# EAGLE design FXOS8700 with Extender (EAGLE 7.3.0)
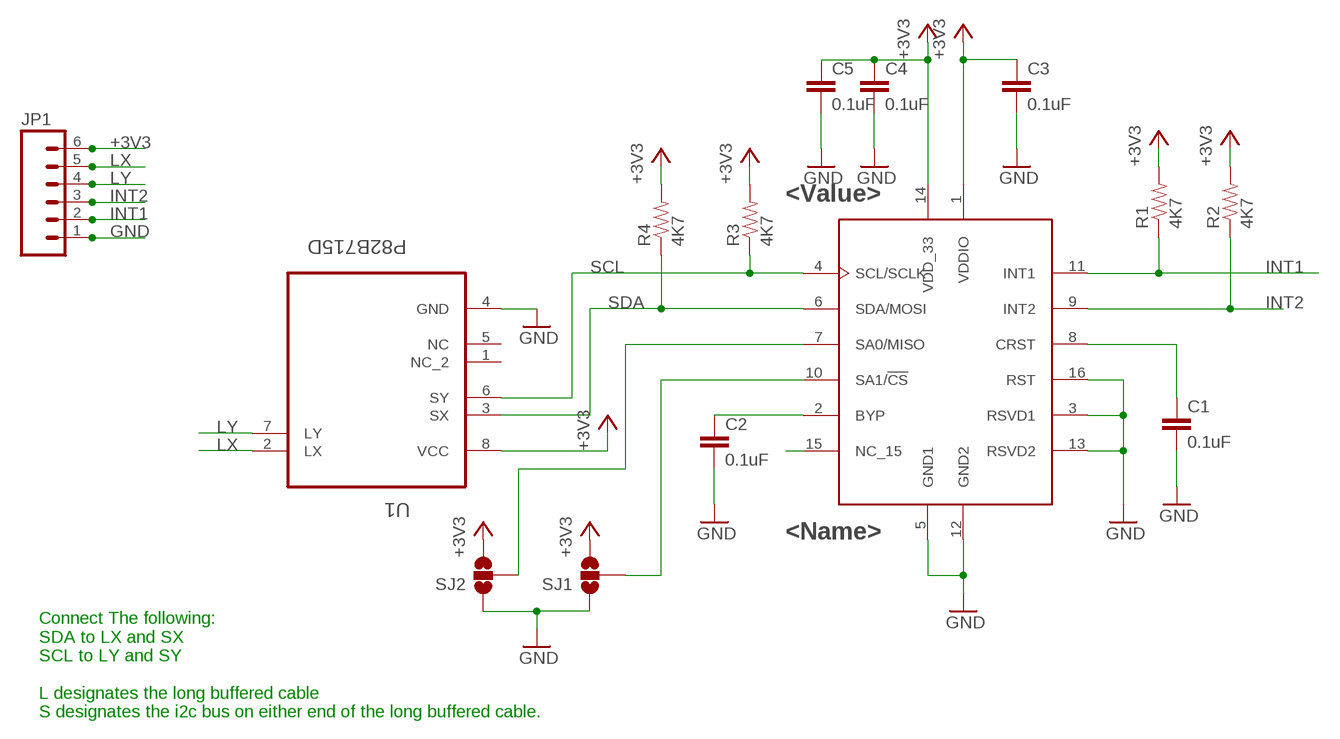
[diagram p0: schematic, sheet 1]

## Parts
C1  0.1uF  CAP0805  [0805]
C2  0.1uF  CAP0805  [0805]
C3  0.1uF  CAP0805  [0805]
C4  0.1uF  CAP0805  [0805]
C5  0.1uF  CAP0805  [0805]
JP1  M06LOCK  [1X06_LOCK]
R1  4K7  RESISTOR0805-RES  [0805]
R2  4K7  RESISTOR0805-RES  [0805]
R3  4K7  RESISTOR0805-RES  [0805]
R4  4K7  RESISTOR0805-RES  [0805]
SJ1  SOLDERJUMPER_2WAYPASTE1&2  [SJ_3_PASTE1&2]
SJ2  SOLDERJUMPER_2WAYPASTE1&2  [SJ_3_PASTE1&2]
U1  P82B715D  [SOIC127P600X175-8N]
U$1  FXOS870CQ  [QFN16_0P5_3X3]

## Nets
+3V3: C3.1 C4.1 C5.1 JP1.6 R1.2 R2.2 R3.2 R4.2 SJ1.3 SJ2.3 U1.8(VCC) U$1.1(VDDIO) U$1.14(VDD_33)
GND: C1.2 C2.2 C3.2 C4.2 C5.2 JP1.1 SJ1.1 SJ2.1 U1.4(GND) U$1.3(RSVD1) U$1.5(GND1) U$1.12(GND2) U$1.13(RSVD2) U$1.16(RST)
INT1: JP1.2 R1.1 U$1.11(INT1)
INT2: JP1.3 R2.1 U$1.9(INT2)
LX: JP1.5 U1.2(LX)
LY: JP1.4 U1.7(LY)
N$5: C2.1 U$1.2(BYP)
N$6: U$1.15(NC_15)
RST: C1.1 U$1.8(CRST)
SA0: SJ2.2 U$1.7(SA0/MISO)
SA1: SJ1.2 U$1.10(SA1/!CS)
SCL: R3.1 U1.6(SY) U$1.4(SCL/SCLK)
SDA: R4.1 U1.3(SX) U$1.6(SDA/MOSI)
Unconnected: U1.1(NC_2) U1.5(NC)

## Notes on the sheet
- Connect The following:
  SDA to LX and SX
  SCL to LY and SY
  
  L designates the long buffered cable
  S designates the i2c bus on either end of the long buffered cable.

## Library data of the parts
C1-C5 = SparkFun-Capacitors:CAP: Capacitor Standard 0603 ceramic capacitor, and 0.1" leaded capacitor.
JP1 = SparkFun-Connectors:M06: Header 6 Standard 6-pin 0.1" header. Use with straight break away headers (SKU : PRT-00116), right angle break away headers (PRT-00553), swiss pins (PRT-00743), machine pins (PRT-00117), and female headers (PRT-00115). Molex polarized connector foot print use with SKU : PRT-08094 with associated crimp pins and housings. NOTES ON THE VARIANTS LOCK and LOCK_LONGPADS... This footprint was designed to help hold the alignment of a through-hole component (i.e. 6-pin header) while soldering it into place. You may notice that each hole has been shifted either up or down by 0.005 of an inch from it's more standard position (which is a perfectly straight line). This slight alteration caused the pins (the squares in the middle) to touch the edges of the holes. Because they are alternating, it causes a "brace" to hold the component in place. 0.005 has proven to be the perfect amount of "off-center" position when using our standard breakaway headers. Although looks a little odd when you look at the bare footprint, once you have a header in there, the alteration is very hard to notice. Also,if you push a header all the way into place, it is covered up entirely on the bottom side. This idea of altering the position of holes to aid alignment will be further integrated into the Sparkfun Library for other footprints. It can help hold any component with 3 or more connection pins.
R1-R4 = SparkFun-Passives:RESISTOR: Resistor Basic schematic elements and footprints for 0603, 1206, and PTH resistors.
SJ1 SJ2 = SparkFun-Passives:SOLDERJUMPER_2WAY: Solder Jumper 2 way solder jumper
U1 = Texas Instruments_By_element14_Batch_1:P82B715D: I2C BUS EXTENDER; MPN: P82B715D; OC_FARNELL: 1604945; OC_NEWARK: 84M9793; PACKAGE: SOIC-8; SUPPLIER: Texas Instruments
U$1 = Freescale_Sensors:FXOS870CQ

## Board
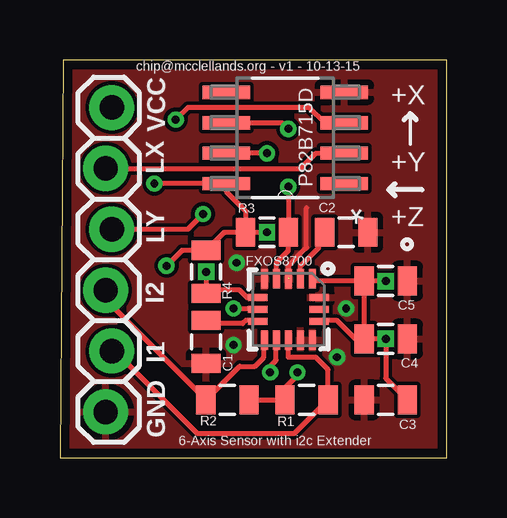
[diagram p1: board, top side]
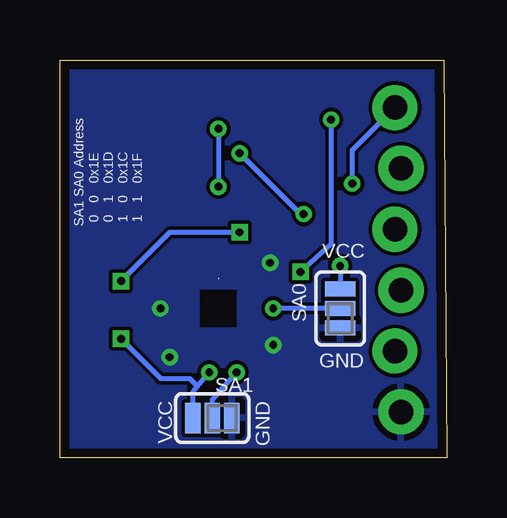
[diagram p2: board, bottom side, seen from below]

Size 16.13 x 16.59 mm. Coordinates in mm from the lower left corner, seen from the top.
Outline: 0,0 16.13,0 16.13,16.59 0.13,16.59 0,0
Copper layers (1*16): Top 0.0356mm / dielectric 1.5011mm / Bottom 0.0356mm
Design rules "OSH_DRC": minimum track width 6mil, minimum drill 13mil, track to track 6mil, track to pad 6mil, pad to pad 6mil, via to via 6mil, smd to smd 6mil, copper to edge 15mil, drill to drill 6mil, minimum pad ring 7mil, minimum via ring 7mil, stop-mask expansion 3mil, vias tented up to drill 15mil, thermal gap 10mil

### Footprints (pad centres in the part's own frame; a part is rotated, then mirrored left to right if it is on the bottom)
0805 = smd 0.8 x 1.2: 1 -0.9,0; 2 0.9,0
1X06_LOCK = drill 1.016 pad 1.88: 1 0,0; 2 2.54,-0.254; 3 5.08,0; 4 7.62,-0.254; 5 10.16,0; 6 12.7,-0.254
SJ_3_PASTE1&2 = smd 0.635 x 1.27: 1 -0.813,0; 2 0,0; 3 0.813,0
SOIC127P600X175-8N = smd 1.981 x 0.559: 1 -2.464,1.905; 2 -2.464,0.635; 3 -2.464,-0.635; 4 -2.464,-1.905; 5 2.464,-1.905; 6 2.464,-0.635; 7 2.464,0.635; 8 2.464,1.905
QFN16_0P5_3X3 = smd 0.813 x 0.305: 1 -1.275,1; 2 -1.275,0.5; 3 -1.275,0; 4 -1.275,-0.5; 5 -1.275,-1; 9 1.275,-1; 10 1.275,-0.5; 11 1.275,0; 12 1.275,0.5; 13 1.275,1 | smd 0.305 x 0.813: 6 -0.5,-1.275; 7 0,-1.275; 8 0.5,-1.275; 14 0.5,1.275; 15 0,1.275; 16 -0.5,1.275

### Placement (x,y rotation side)
C1  6.1,4.83 270 top
C2  11.94,9.4 0 top
C3  13.59,2.41 180 top
C4  13.59,4.95 0 top
C5  13.59,7.37 0 top
JP1  1.91,1.91 90 top
R1  10.29,2.41 180 top
R2  6.99,2.41 0 top
R3  8.64,9.4 180 top
R4  6.1,7.75 90 top
SJ1  9.78,1.65 180 bottom
SJ2  4.45,6.22 90 bottom
U1  9.4,13.34 180 top
U$1  9.53,6.18 270 top

### Tracks (layer width: path | path; a pad name or v marks a point on that pad's centre or on a via)
+3V3  (via drill 0.33)
  Top 0.203: C5.1 10.62,7.37 U$1.1 | U$1.14 10.84,5.71 11.56,5.71 12.32,4.95 C4.1 | R3.2 7.75,10.29 6.93,11.1 U1.8 v3.94,11.43 | R3.2 6.85,9.4 R4.2 5.09,8.65 v4.45,8 | R2.2 R1.2 | R1.2 9.39,2.55 | C4.1 v13.59,4.95 13.59,3.31 C3.1 | C4.1 12.7,7.36 C5.1 | R3.2 8.62,9.41 v8.64,9.4 | v13.59,7.37 C5.1 | v9.91,3.56 9.91,3.43 9.4,2.92 9.4,2.42 R1.2
  Bottom 0.203: v13.59,4.95 11.94,3.3 10.72,3.3 10.4,2.98 | v8.64,9.4 11.56,9.4 v13.59,7.37 | v3.94,11.43 3.94,12.83 JP1.6 | v4.45,8 SJ2.3 | SJ1.3 10.59,2.74 10.4,2.98 | 10.4,2.98 v9.91,3.56
GND  (via drill 0.33)  (1 unrouted)
  Top 0.203: 9.53,7.49 9.53,8 10.29,8.76 10.29,10.41
  other vias: 11.56,4.19 7.37,8.13 11.94,6.22 7.24,4.7
  pour Bottom: 0,0 17.02,-0.13 17.15,16.84 -0.13,16.71
  pour Top: -0.25,-0.38 17.15,-0.38 17.28,16.46 -0.38,16.46
INT1
  Top 0.203: JP1.2 2.29,4.45 5.71,1.02 9.79,1.02 R1.1 11.19,3.67 10.67,4.19 9.53,4.19 U$1.11
INT2
  Top 0.203: U$1.9 8.51,4.89 8.51,4.19 8.13,3.81 7.49,3.81 6.1,2.41 R2.1 1.91,6.59 JP1.3
LX
  Top 0.203: JP1.5 10.03,12.06 10.67,12.7 U1.2
LY  (via drill 0.33)
  Top 0.203: JP1.4 5.33,9.53 v5.97,10.16 | v8.64,12.7 U1.7
  Bottom 0.203: v5.97,10.16 6.1,10.16 v8.64,12.7
N$1
  cutout Top: 8.76,6.99 10.29,6.99 10.29,5.46 8.76,5.46
  cutout Bottom: 8.76,6.99 10.29,6.99 10.29,5.46 8.76,5.46
N$5
  Top 0.203: C2.1 11.04,9.26 | U$1.2 10.03,8 10.79,8.76 10.79,9.15 C2.1 | 11.05,9.39 C2.1
RST
  Top 0.203: U$1.8 8.21,5.73 7.76,5.73 7.62,5.59 6.23,5.59 C1.1
SA0  (via drill 0.33)
  Top 0.203: v7.24,6.22 8.21,6.22 U$1.7
  Bottom 0.203: SJ2.2 v7.24,6.22
SA1  (via drill 0.33)
  Top 0.203: v8.76,3.56 8.76,3.81 9.02,4.06 9.02,4.9 U$1.10
  Bottom 0.203: SJ1.2 9.78,2.41 v8.76,3.56
SCL  (via drill 0.33)
  Top 0.203: U$1.4 9.03,8.14 9.53,8.64 9.53,9.39 R3.1 9.53,9.41 v9.53,11.3 | U1.6 9.27,13.97 v9.53,13.72
  Bottom 0.203: v9.53,13.72 v9.53,11.3
SDA  (via drill 0.33)
  Top 0.203: v4.83,14.1 5.33,14.61 10.41,14.61 11.05,13.97 U1.3 | v6.1,7.75 R4.1 6.23,6.99 7.49,6.99 7.8,6.68 8.18,6.68 U$1.6
  Bottom 0.203: v4.83,14.1 4.83,8.89 v6.1,7.75

### Text on the board
tPlace: chip@mcclellands.org - v1 - 10-13-15 | +X | VCC | LX | +Y | P82B715D | +Z | LY | FXOS8700 | I2 | I1 | GND | 6-Axis Sensor with i2c Extender
bPlace: SA1 SA0 Address / 0 0 0x1E / 0 1 0x1D / 1 0 0x1C / 1 1 0x1F | VCC | SA0 | GND | SA1 | GND | VCC